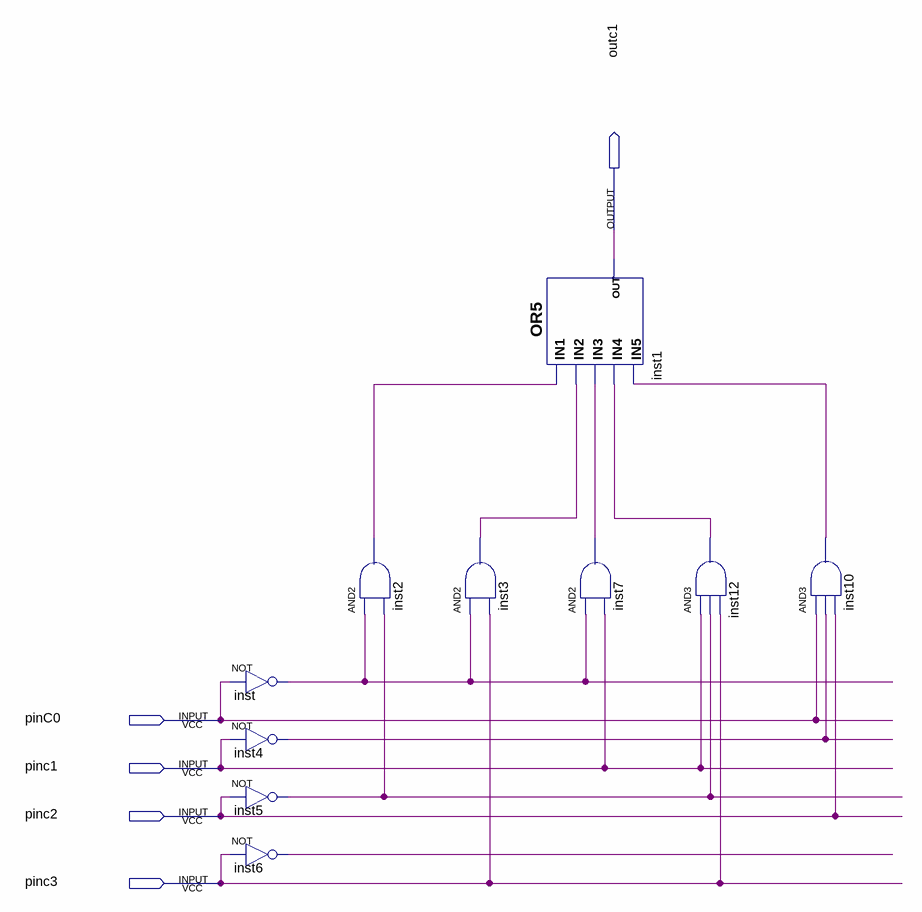
[diagram p0: schematic sheet]
// Quartus schematic OriginalC.bdf as structural Verilog: 10 symbols, 5 pins
module OriginalC (
  input  pinC0,
  input  pinc1,
  input  pinc2,
  input  pinc3,
  output outc1
);

  wire inst2_out, inst3_out, inst4_out, inst5_out, inst6_out, inst7_out, inst10_out, inst12_out, inst_out;

  not inst (inst_out, pinC0);
  not inst4 (inst4_out, pinc1);
  not inst5 (inst5_out, pinc2);
  not inst6 (inst6_out, pinc3);
  and inst2 (inst2_out, inst_out, inst5_out);
  and inst3 (inst3_out, inst_out, pinc3);
  or inst1 (outc1, inst2_out, inst3_out, inst7_out, inst12_out, inst10_out);
  and inst7 (inst7_out, inst_out, pinc1);
  and inst12 (inst12_out, pinc1, inst5_out, pinc3);
  and inst10 (inst10_out, pinC0, inst4_out, pinc2);
endmodule
